# EAGLE schematic mosfet (EAGLE 7.7.0)
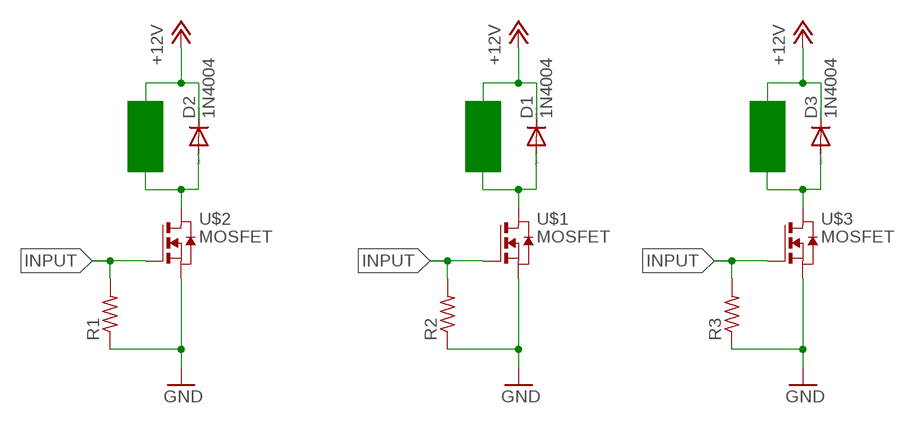
[diagram p0: schematic, sheet 1]

## Parts
D1  1N4004  [DO41-10]
D2  1N4004  [DO41-10]
D3  1N4004  [DO41-10]
R1  R-US_R0603  [R0603]
R2  R-US_R0603  [R0603]
R3  R-US_R0603  [R0603]
U$1  MOSFET  [MOSFET]
U$2  MOSFET  [MOSFET]
U$3  MOSFET  [MOSFET]

## Nets
+12V: D1.C D2.C D3.C
GND: R1.1 R2.1 R3.1 U$1.P$3(S) U$2.P$3(S) U$3.P$3(S)
N$1: R2.2 U$1.P$1(G)
N$2: D1.A U$1.P$2(D)
N$3: D2.A U$2.P$2(D)
N$4: R1.2 U$2.P$1(G)
N$5: D3.A U$3.P$2(D)
N$6: R3.2 U$3.P$1(G)

## Library data of the parts
D1-D3 = diode:1N4004: DIODE general purpose rectifier, 1 A
R1-R3 = resistor:R-US_: RESISTOR, American symbol
U$1-U$3 = MOSFET:MOSFET